# EAGLE design bristol_longshot_development (EAGLE 6.6.0)
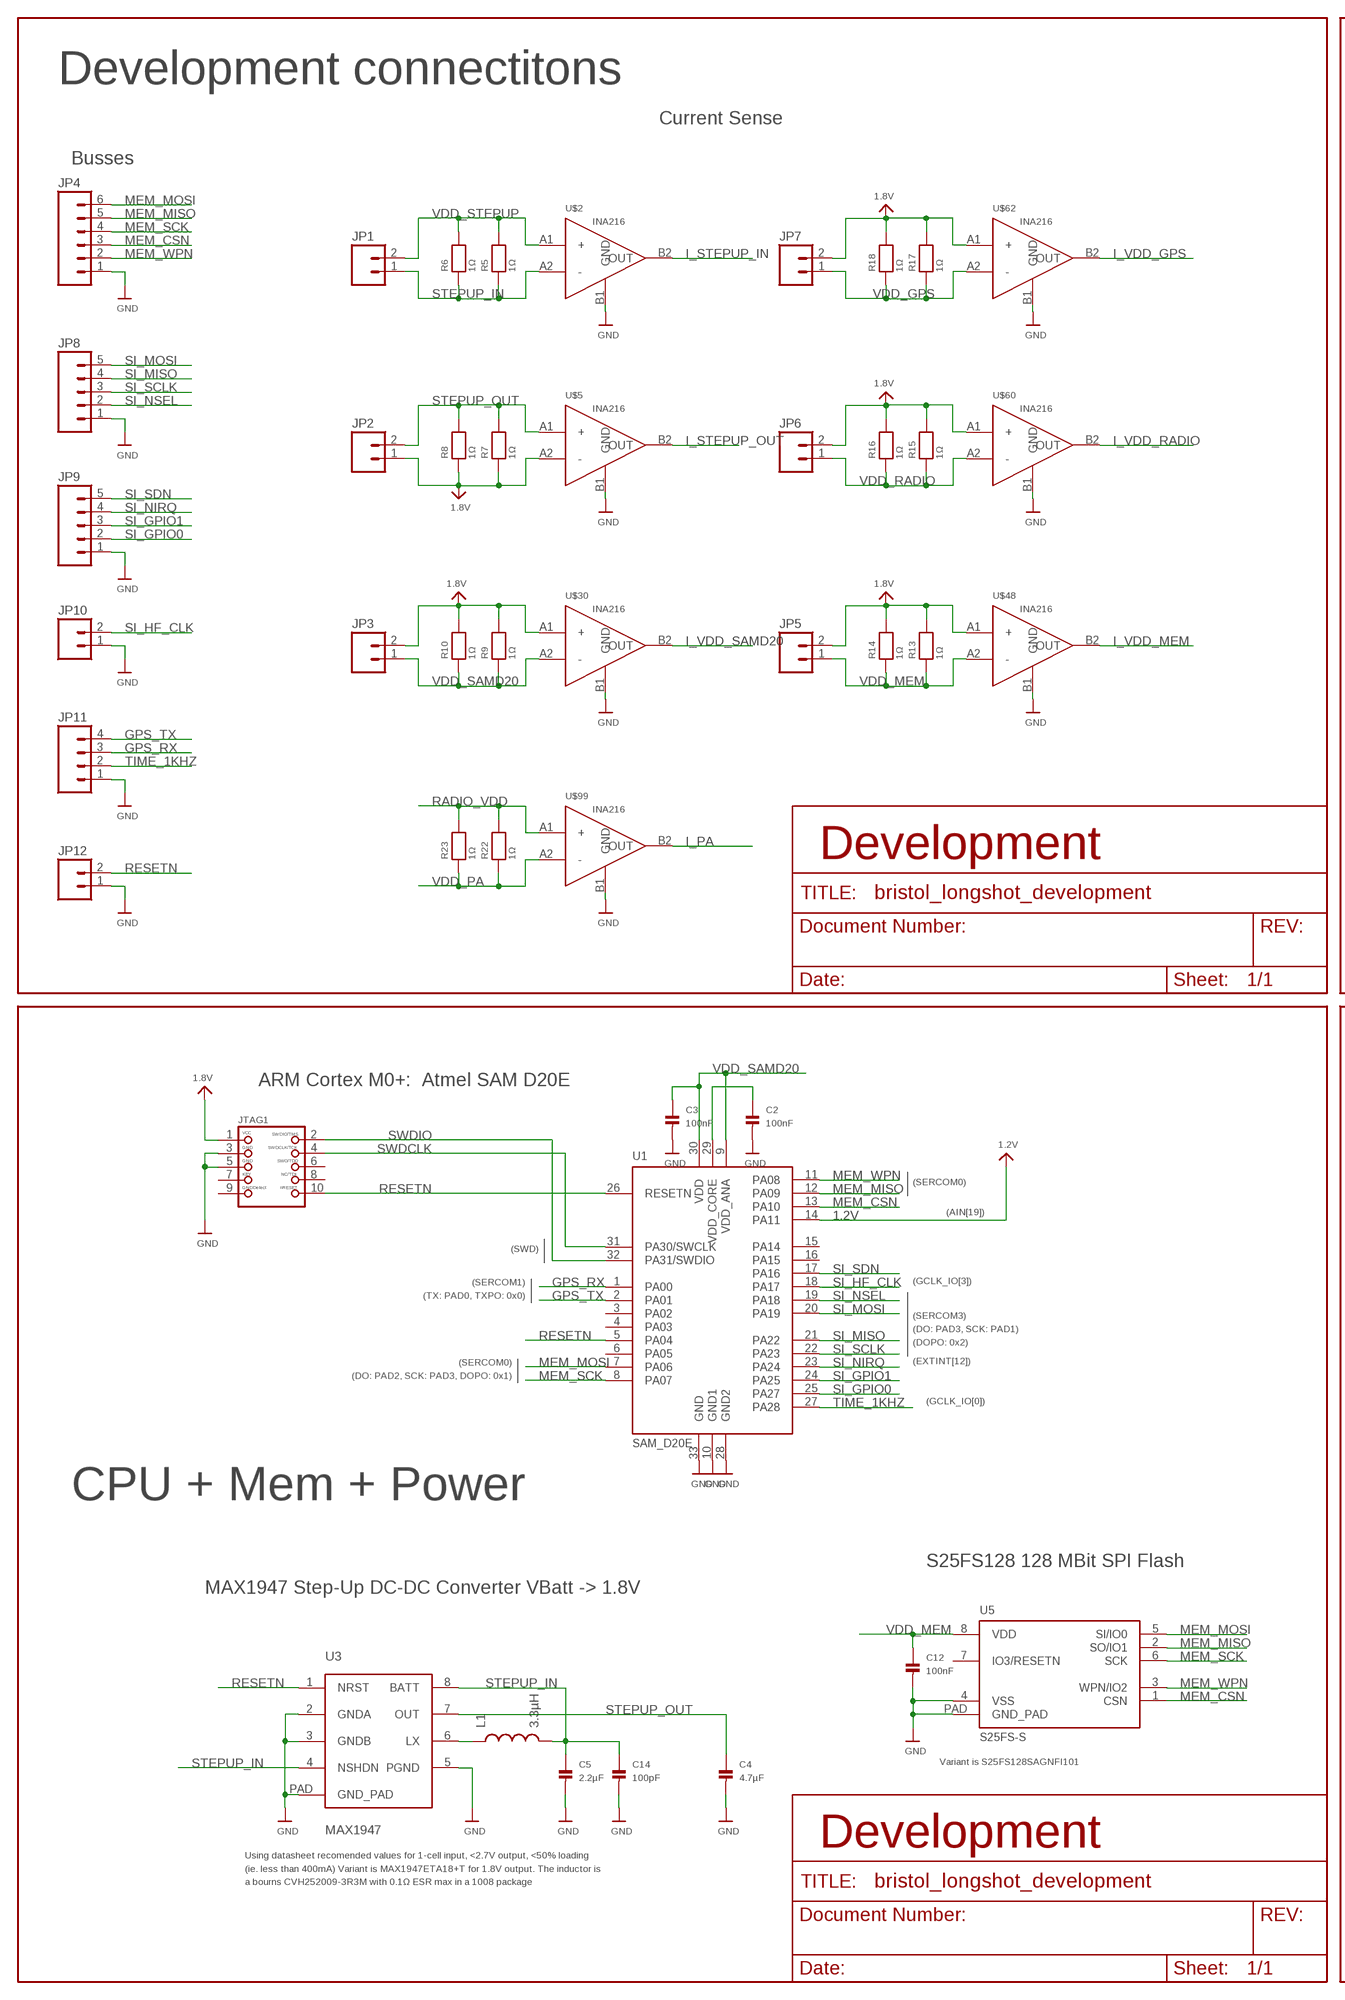
[diagram p0: schematic, sheet 1, part 1 of 2]
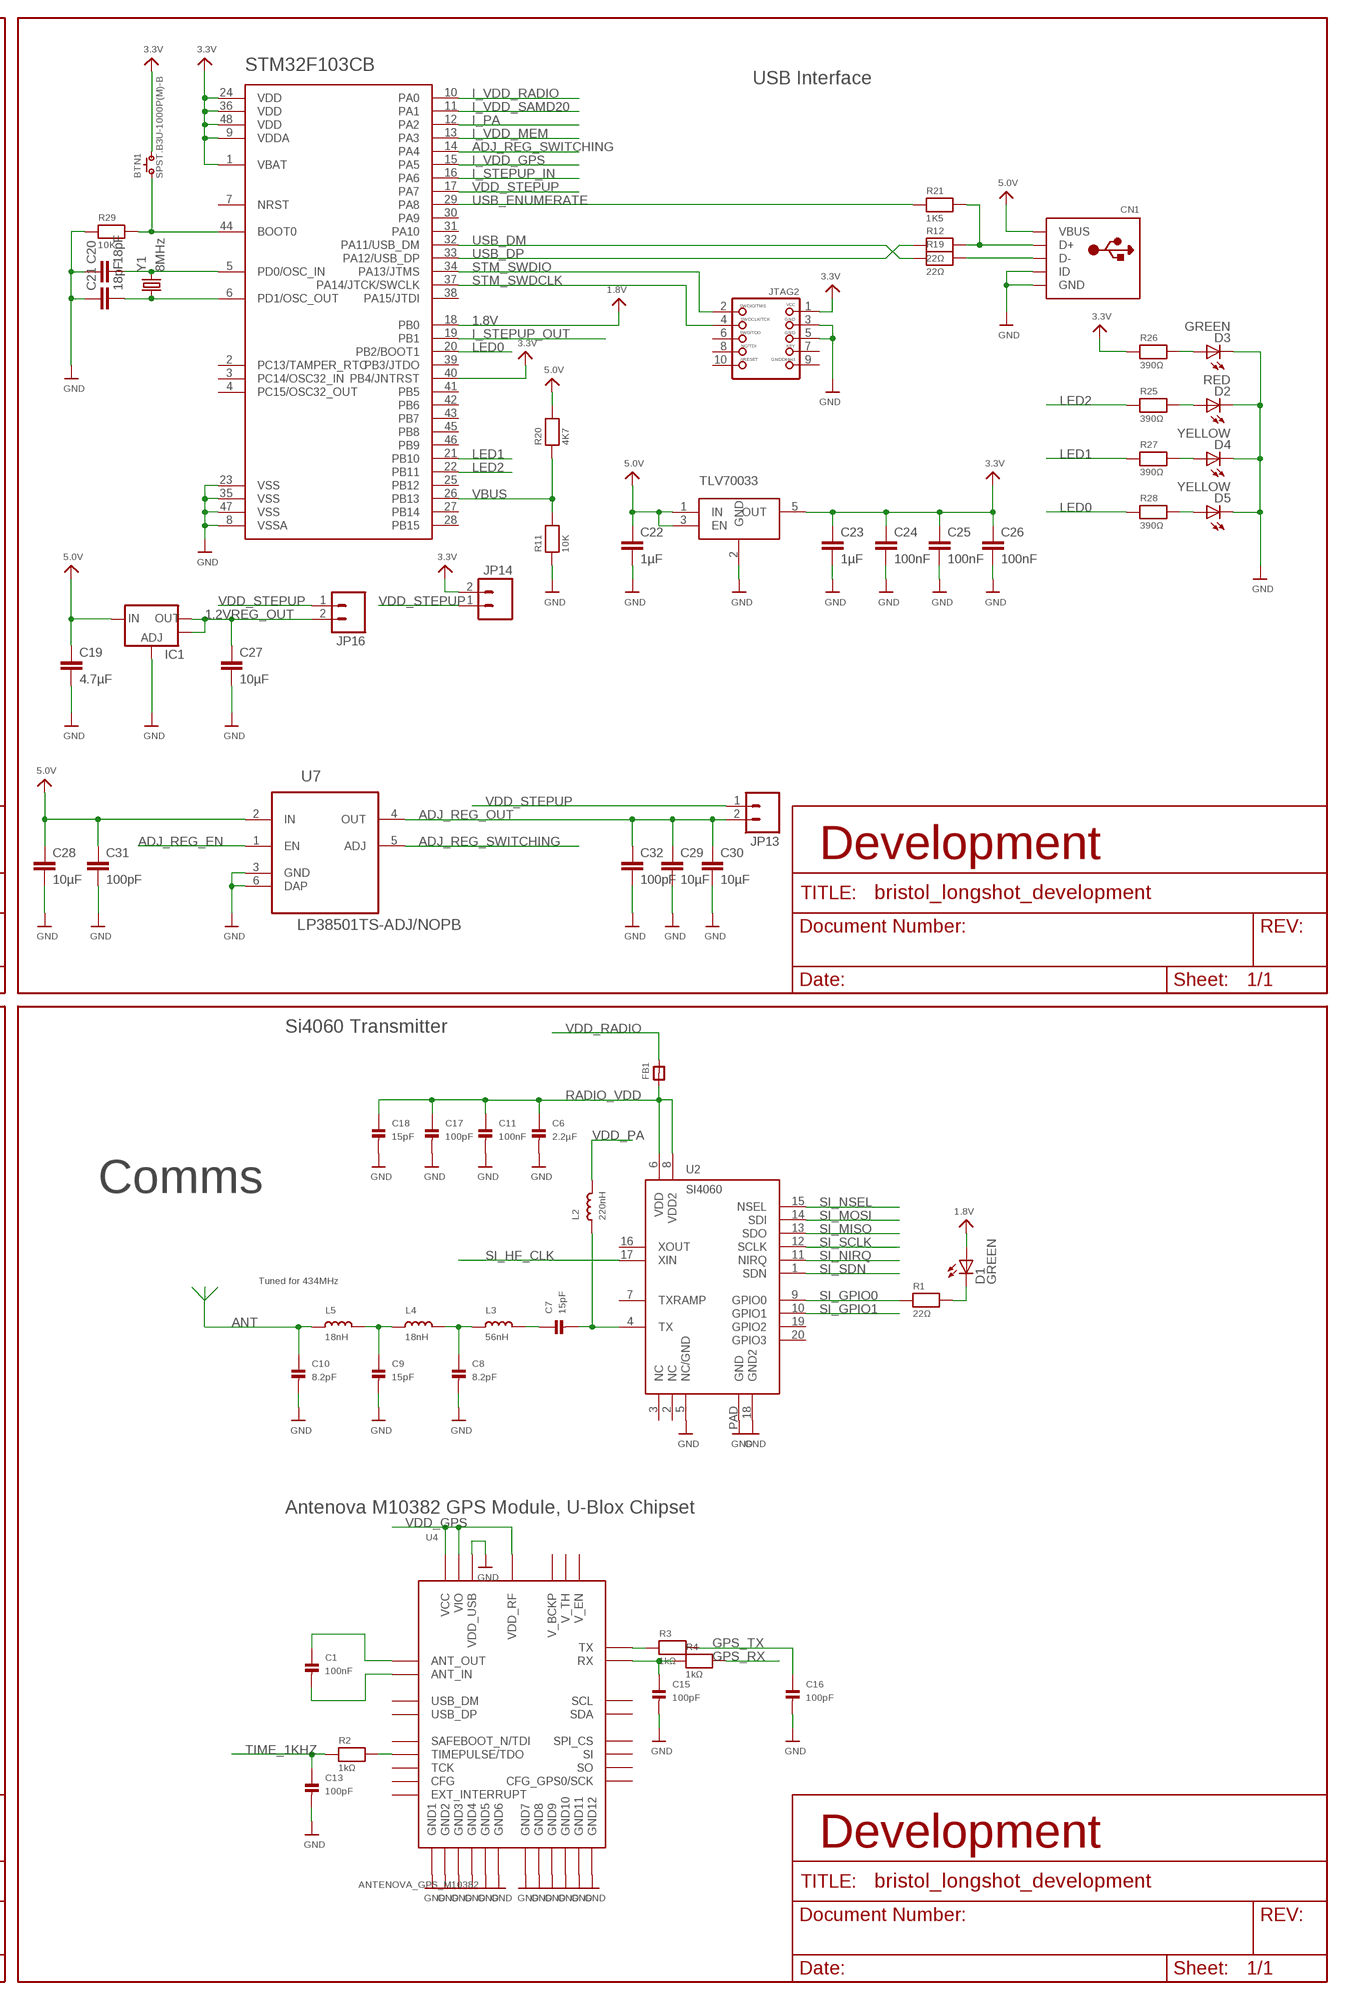
[diagram p1: schematic, sheet 1, part 2 of 2]

## Parts
BTN1  SPST.B3U-1000P(M)-B  [B3U-1000P(M)-B]
C1  100nF  CAP_CERAMIC_0402  [_0402]
C2  100nF  CAP_CERAMIC_0402  [_0402]
C3  100nF  CAP_CERAMIC_0402  [_0402]
C4  4.7µF  CAP_CERAMIC_0402  [_0402]
C5  2.2µF  CAP_CERAMIC_0402  [_0402]
C6  2.2µF  CAP_CERAMIC_0402  [_0402]
C7  15pF  CAP_CERAMIC_0402  [_0402]
C8  8.2pF  CAP_CERAMIC_0402  [_0402]
C9  15pF  CAP_CERAMIC_0402  [_0402]
C10  8.2pF  CAP_CERAMIC_0402  [_0402]
C11  100nF  CAP_CERAMIC_0402  [_0402]
C12  100nF  CAP_CERAMIC_0402  [_0402]
C13  100pF  CAP_CERAMIC_0402  [_0402]
C14  100pF  CAP_CERAMIC_0402  [_0402]
C15  100pF  CAP_CERAMIC_0402  [_0402]
C16  100pF  CAP_CERAMIC_0402  [_0402]
C17  100pF  CAP_CERAMIC_0402  [_0402]
C18  15pF  CAP_CERAMIC_0402  [_0402]
C19  4.7µF  C-EUC0603K  [C0603K]
C20  18pF  C-EUC0603K  [C0603K]
C21  18pF  C-EUC0603K  [C0603K]
C22  1µF  C-EUC0603K  [C0603K]
C23  1µF  C-EUC0603K  [C0603K]
C24  100nF  C-EUC0603K  [C0603K]
C25  100nF  C-EUC0603K  [C0603K]
C26  100nF  C-EUC0603K  [C0603K]
C27  10µF  C-EUC0603K  [C0603K]
C28  10µF  C-EUC0603K  [C0603K]
C29  10µF  C-EUC0603K  [C0603K]
C30  10µF  C-EUC0603K  [C0603K]
C31  100pF  C-EUC0603K  [C0603K]
C32  100pF  C-EUC0603K  [C0603K]
CN1  USBMINIB  [USB-MINIB]
D1  GREEN  LEDCHIPLED_0603  [CHIPLED_0603]
D2  RED  LEDCHIPLED_0603  [CHIPLED_0603]
D3  GREEN  LEDCHIPLED_0603  [CHIPLED_0603]
D4  YELLOW  LEDCHIPLED_0603  [CHIPLED_0603]
D5  YELLOW  LEDCHIPLED_0603  [CHIPLED_0603]
FB1  FERRITE_0402  [_0402]
IC1  V_REG_LM1117SOT223  [SOT223]
IC3  TLV70033DCK  TLV700DCK  [SC70-5L]
JP1  M02LOCK  [1X02_LOCK]
JP2  M02LOCK  [1X02_LOCK]
JP3  M02LOCK  [1X02_LOCK]
JP4  M06LOCK  [1X06_LOCK]
JP5  M02LOCK  [1X02_LOCK]
JP6  M02LOCK  [1X02_LOCK]
JP7  M02LOCK  [1X02_LOCK]
JP8  M05LOCK  [1X05_LOCK]
JP9  M05LOCK  [1X05_LOCK]
JP10  M02LOCK  [1X02_LOCK]
JP11  M04LOCK  [1X04_LOCK]
JP12  M02LOCK  [1X02_LOCK]
JP13  M02LOCK  [1X02_LOCK]
JP14  M02LOCK  [1X02_LOCK]
JP16  M02LOCK  [1X02_LOCK]
JTAG1  JTAG-CORTEXM3SMT  [2X05_1.27MM_SMT]
JTAG2  JTAG-CORTEXM3SMT  [2X05_1.27MM_SMT]
L1  3.3µH  INDUCTOR1007  [1007]
L2  220nH  INDUCTOR_0402  [_0402]
L3  56nH  INDUCTOR_0402  [_0402]
L4  18nH  INDUCTOR_0402  [_0402]
L5  18nH  INDUCTOR_0402  [_0402]
R1  22Ω  RESISTOR_0402  [_0402]
R2  1kΩ  RESISTOR_0402  [_0402]
R3  1kΩ  RESISTOR_0402  [_0402]
R4  1kΩ  RESISTOR_0402  [_0402]
R5  1Ω  RESISTOR_0402  [_0402]
R6  1Ω  RESISTOR_0402  [_0402]
R7  1Ω  RESISTOR_0402  [_0402]
R8  1Ω  RESISTOR_0402  [_0402]
R9  1Ω  RESISTOR_0402  [_0402]
R10  1Ω  RESISTOR_0402  [_0402]
R11  10K  RESISTOR0603MINI  [0603-MINI]
R12  22Ω  RESISTOR0603MINI  [0603-MINI]
R13  1Ω  RESISTOR_0402  [_0402]
R14  1Ω  RESISTOR_0402  [_0402]
R15  1Ω  RESISTOR_0402  [_0402]
R16  1Ω  RESISTOR_0402  [_0402]
R17  1Ω  RESISTOR_0402  [_0402]
R18  1Ω  RESISTOR_0402  [_0402]
R19  22Ω  RESISTOR0603MINI  [0603-MINI]
R20  4K7  RESISTOR0603MINI  [0603-MINI]
R21  1K5  RESISTOR0603MINI  [0603-MINI]
R22  1Ω  RESISTOR_0402  [_0402]
R23  1Ω  RESISTOR_0402  [_0402]
R25  390Ω  RESISTOR0603MINI  [0603-MINI]
R26  390Ω  RESISTOR0603MINI  [0603-MINI]
R27  390Ω  RESISTOR0603MINI  [0603-MINI]
R28  390Ω  RESISTOR0603MINI  [0603-MINI]
R29  10K  RESISTOR0603MINI  [0603-MINI]
U1  SAM_D20E  [QFN32_5MM]
U2  SI4060  [QFN20]
U3  MAX1947  [TDFN8]
U4  ANTENOVA_GPS_M10382  [ANTENOVA_GPS_M10382]
U5  S25FS-S  [WSON8]
U6  STM32F_48PIN  [TQFP48]
U7  LP38501TS-ADJ/NOPB  [TO170P1435X457-6N]
U$2  INA216  [WCSP-4]
U$5  INA216  [WCSP-4]
U$30  INA216  [WCSP-4]
U$48  INA216  [WCSP-4]
U$60  INA216  [WCSP-4]
U$62  INA216  [WCSP-4]
U$99  INA216  [WCSP-4]
Y1  8MHz  CRYSTAL5X3  [CRYSTAL-SMD-5X3]

## Nets
1.2V: U1.14(PA11)
1.2VREG_OUT: C27.1 IC1.2(OUT) IC1.4(OUT) JP16.2
1.8V: D1.A JP2.1 JP3.2 JP5.2 JP6.2 JP7.2 JTAG1.1 R7.1 R8.1 R9.2 R10.2 R13.2 R14.2 R15.2 R16.2 R17.2 R18.2 U6.18(PB0) U$5.A2(-) U$30.A1(+) U$48.A1(+) U$60.A1(+) U$62.A1(+)
3.3V: BTN1.2 C23.1 C24.1 C25.1 C26.1 IC3.5(OUT) JP14.2 JTAG2.1 R26.1 U6.1(VBAT) U6.9(VDDA) U6.24(VDD) U6.36(VDD) U6.40(PB4/JNTRST) U6.48(VDD)
5.0V: C19.1 C22.1 C28.1 C31.1 CN1.VBUS IC1.3(IN) IC3.1(IN) IC3.3(EN) R20.2 U7.2(IN)
ADJ_REG_EN: U7.1(EN)
ADJ_REG_OUT: C29.1 C30.1 C32.1 JP13.2 U7.4(OUT)
ADJ_REG_SWITCHING: U6.14(PA4) U7.5(ADJ)
AN_GPS_RX: C15.1 R4.1 U4.13_RX(RX)
AN_GPS_TX: R3.1 U4.11_TX(TX)
ANT: C10.1 L5.1
BOOT0: BTN1.1 R29.2 U6.44(BOOT0)
D+: CN1.D+ R12.2 R21.2
D-: CN1.D- R19.2
FILTER1: C8.1 L3.1 L4.2
FILTER2: C9.1 L4.1 L5.2
GND: C2.2 C3.2 C4.2 C5.2 C6.2 C8.2 C9.2 C10.2 C11.2 C12.2 C13.2 C14.2 C15.2 C16.2 C17.2 C18.2 C19.2 C20.1 C21.1 C22.2 C23.2 C24.2 C25.2 C26.2 C27.2 C28.2 C29.2 C30.2 C31.2 C32.2 CN1.GND CN1.ID D2.C D3.C D4.C D5.C IC1.1(ADJ) IC3.2(GND) JP4.1 JP8.1 JP9.1 JP10.1 JP11.1 JP12.1 JTAG1.3 JTAG1.5 JTAG2.3 JTAG2.5 R11.1 R29.1 U1.10(GND1) U1.28(GND2) U1.33(GND) U2.5(NC/GND) U2.18(GND2) U2.PAD(GND) U3.2(GNDA) U3.3(GNDB) U3.5(PGND) U3.PAD(GND_PAD) U4.2_GND(GND1) U4.4_GND(GND2) U4.14_GND(GND3) U4.17_GND(GND4) U4.21_GND(GND5) U4.24_GND(GND6) U4.26_GND(GND7) U4.28_GND(GND8) U4.32_VDD_USB(VDD_USB) U4.33_GND(GND9) U4.34_GND(GND10) U4.35_GND(GND11) U4.36_GND(GND12) U5.4(VSS) U5.PAD(GND_PAD) U6.8(VSSA) U6.23(VSS) U6.35(VSS) U6.47(VSS) U7.3(GND) U7.6(DAP) U$2.B1(GND) U$5.B1(GND) U$30.B1(GND) U$48.B1(GND) U$60.B1(GND) U$62.B1(GND) U$99.B1(GND)
GPS_ANT_IN: C1.2 U4.1_ANT_IN(ANT_IN)
GPS_ANT_OUT: C1.1 U4.3_ANT_OUT(ANT_OUT)
GPS_RX: JP11.3 R4.2 U1.1(PA00)
GPS_TX: C16.1 JP11.4 R3.2 U1.2(PA01)
I_PA: U6.12(PA2) U$99.B2(OUT)
I_STEPUP_IN: U6.16(PA6) U$2.B2(OUT)
I_STEPUP_OUT: U6.19(PB1) U$5.B2(OUT)
I_VDD_GPS: U6.15(PA5) U$62.B2(OUT)
I_VDD_MEM: U6.13(PA3) U$48.B2(OUT)
I_VDD_RADIO: U6.10(PA0) U$60.B2(OUT)
I_VDD_SAMD20: U6.11(PA1) U$30.B2(OUT)
LED0: R28.1 U6.20(PB2/BOOT1)
LED1: R27.1 U6.21(PB10)
LED2: R25.1 U6.22(PB11)
LED_RES: D1.C R1.2
LPC_XTAL2: C21.2 U6.6(PD1/OSC_OUT) Y1.1
LX: L1.1 U3.6(LX)
MEM_CSN: JP4.3 U1.13(PA10) U5.1(CSN)
MEM_MISO: JP4.5 U1.12(PA09) U5.2(SO/IO1)
MEM_MOSI: JP4.6 U1.7(PA06) U5.5(SI/IO0)
MEM_SCK: JP4.4 U1.8(PA07) U5.6(SCK)
MEM_WPN: JP4.2 U1.11(PA08) U5.3(WPN/IO2)
N$2: D2.A R25.2
N$4: D3.A R26.2
N$6: D4.A R27.2
N$8: D5.A R28.2
OSC_IN: C20.2 U6.5(PD0/OSC_IN) Y1.3
RADIO_VDD: C6.1 C11.1 C17.1 C18.1 FB1.1 R22.2 R23.2 U2.6(VDD) U2.8(VDD2) U$99.A1(+)
RESETN: JP12.2 JTAG1.10 U1.5(PA04) U1.26(RESETN) U3.1(NRST)
RF_OUT: C7.2 L2.1 U2.4(TX)
SI_GPIO0: JP9.2 R1.1 U1.25(PA27) U2.9(GPIO0)
SI_GPIO1: JP9.3 U1.24(PA25) U2.10(GPIO1)
SI_HF_CLK: JP10.2 U1.18(PA17) U2.17(XIN)
SI_MISO: JP8.4 U1.21(PA22) U2.13(SDO)
SI_MOSI: JP8.5 U1.20(PA19) U2.14(SDI)
SI_NIRQ: JP9.4 U1.23(PA24) U2.11(NIRQ)
SI_NSEL: JP8.2 U1.19(PA18) U2.15(NSEL)
SI_SCLK: JP8.3 U1.22(PA23) U2.12(SCLK)
SI_SDN: JP9.5 U1.17(PA16) U2.1(SDN)
STEPUP_IN: C5.1 C14.1 JP1.1 L1.2 R5.1 R6.1 U3.4(NSHDN) U3.8(BATT) U$2.A2(-)
STEPUP_OUT: C4.1 JP2.2 R7.2 R8.2 U3.7(OUT) U$5.A1(+)
STM_SWDCLK: JTAG2.4 U6.37(PA14/JTCK/SWCLK)
STM_SWDIO: JTAG2.2 U6.34(PA13/JTMS)
SWDCLK: JTAG1.4 U1.31(PA30/SWCLK)
SWDIO: JTAG1.2 U1.32(PA31/SWDIO)
TANK: C7.1 L3.2
TIME_1KHZ: C13.1 JP11.2 R2.1 U1.27(PA28)
TIME_1KHZ_DRIVE: R2.2 U4.23_TIMEPULSE/TDO(TIMEPULSE/TDO)
USB_DM: R19.1 U6.32(PA11/USB_DM)
USB_DP: R12.1 U6.33(PA12/USB_DP)
USB_ENUMERATE: R21.1 U6.29(PA8)
VBUS: R11.2 R20.1 U6.26(PB13)
VDD_CORE: C2.1 U1.29(VDD_CORE)
VDD_GPS: JP7.1 R17.1 R18.1 U4.5_VIO(VIO) U4.25_VDD_RF(VDD_RF) U4.27_VCC(VCC) U$62.A2(-)
VDD_MEM: C12.1 JP5.1 R13.1 R14.1 U5.8(VDD) U$48.A2(-)
VDD_PA: L2.2 R22.1 R23.1 U$99.A2(-)
VDD_RADIO: FB1.2 JP6.1 R15.1 R16.1 U$60.A2(-)
VDD_SAMD20: C3.1 JP3.1 R9.1 R10.1 U1.9(VDD_ANA) U1.30(VDD) U$30.A2(-)
VDD_STEPUP: JP1.2 JP13.1 JP14.1 JP16.1 R5.2 R6.2 U6.17(PA7) U$2.A1(+)
Unconnected: JTAG1.6 JTAG1.7 JTAG1.8 JTAG1.9 JTAG2.6 JTAG2.7 JTAG2.8 JTAG2.9 JTAG2.10 U1.3(PA02) U1.4(PA03) U1.6(PA05) U1.15(PA14) U1.16(PA15) U2.2(NC) U2.3(NC ) U2.7(TXRAMP) U2.16(XOUT) U2.19(GPIO2) U2.20(GPIO3) U4.6_USB_DP(USB_DP) U4.7_USB_DM(USB_DM) U4.8_SO(SO) U4.9_CFG_GPS0_SCK(CFG_GPS0/SCK) U4.10_SPI_SELECT(SPI_CS) U4.12_V_TH(V_TH) U4.15_V_BCKUP(V_BCKP) U4.16_SI(SI) U4.18_SDA(SDA) U4.19_SCL(SCL) U4.20_SAFEBOOT_N/TDI(SAFEBOOT_N/TDI) U4.22_TCK(TCK) U4.29_EXT_INTERRUPT(EXT_INTERRUPT) U4.30_V_EN(V_EN) U4.31_CFG(CFG) U5.7(IO3/RESETN) U6.2(PC13/TAMPER_RTC) U6.3(PC14/OSC32_IN) U6.4(PC15/OSC32_OUT) U6.7(NRST) U6.25(PB12) U6.27(PB14) U6.28(PB15) U6.30(PA9) U6.31(PA10) U6.38(PA15/JTDI) U6.39(PB3/JTDO) U6.41(PB5) U6.42(PB6) U6.43(PB7) U6.45(PB8) U6.46(PB9)

## Notes on the sheet
- STM32F103CB
- Development connectitons | USB Interface
- Current Sense
- Busses
- TLV70033
- Development | Development
- Si4060 Transmitter
- ARM Cortex M0+:  Atmel SAM D20E
- (SERCOM0)
- Comms
- (AIN[19])
- (SWD)
- (SERCOM1) | (GCLK_IO[3]) | Tuned for 434MHz
- (TX: PAD0, TXPO: 0x0)
- (SERCOM3)
- (DO: PAD3, SCK: PAD1)
- (DOPO: 0x2)
- (SERCOM0) | (EXTINT[12])
- (DO: PAD2, SCK: PAD3, DOPO: 0x1)
- (GCLK_IO[0])
- CPU + Mem + Power
- Antenova M10382 GPS Module, U-Blox Chipset
- S25FS128 128 MBit SPI Flash
- MAX1947 Step-Up DC-DC Converter VBatt -> 1.8V
- Variant is S25FS128SAGNFI101
- Development | Development
- Using datasheet recomended values for 1-cell input, <2.7V output, <50% loading 
  (ie. less than 400mA) Variant is MAX1947ETA18+T for 1.8V output. The inductor is 
  a bourns CVH252009-3R3M with 0.1Ω ESR max in a 1008 package

## Library data of the parts
BTN1 = omron:SPST
C1-C18 = microbuilder_v3:CAP_CERAMIC: Ceramic Capacitors 0402 - 0402 Surface Mount Capacitors 16pF 50V 5% [Digikey: 445-4899-2-ND] 18pF 50V 5% [Digikey: 490-1281-2-ND] 22pF 50V 5% [Digikey: 490-1283-2-ND] 68pF 50V 5% [Digikey: 490-1289-2-ND] 0.1uF 10V 10% [Digikey: 490-1318-2-ND] 1.0uF 6.3V 10% [Digikey: 490-1320-2-ND] 0603 - 0603 Surface Mount Capacitors 16 pF 50V 5% [Digikey: 445-5051-2-ND] 22 pF 50V [Digikey: PCC220ACVTR-ND] 33 pF 50V 5% [Digikey: 490-1415-1-ND] 56pF 50V 5% [Digikey: 490-1421-1-ND] 220pF 50V 5% [Digikey: 445-1285-1-ND] 680 pF 50V 2200 pF 50V 5% C0G [Digikey: 445-1297-1-ND] 5600 pF 100V 5% X7R [Digikey: 478-3711-1-ND] 0.1 µF 25V 10% [Digikey: PCC2277TR-ND] 0.22 µF 16V 10% X7R [Digikey: 445-1318-1-ND] 1.0 µF 25V 10% [Digikey: 445-5146-2-ND] 0603 - RF Specific 3pF 250V +/-0.1pF RF [Digikey: 712-1347-1-ND] 18 pF 250V 5% [Digikey: 478-3505-1-ND or 712-1322-1-ND] 56 pF 250V 5% C0G RF [Digikey: 490-4867-1-ND] 68 pF 250V RF [Digikey: 490-4868-1-ND] 0805 - 0805 Surface Mount Capacitors 220 pF 250V 2% RF Ceramic Capacitor [Digikey: 712-1398-1-ND] 1000 pF 50V 2% NP0 Ceramic Capacitor [Digikey: 478-3760-1-ND] 0.1 µF 25V 10% Ceramic Capacitor [Digikey: PCC1828TR-ND] 1.0 µF 16V 10% Ceramic Capacitor[Digikey: 490-1691-2-ND] 10.0 µF 10V 10% Ceramic Capacitor[Digikey: 709-1228-1-ND] 10.0 uF 16V 10% Ceramic Capacitor [Digikey: 478-5165-2-ND] 47 uF 6.3V 20% Ceramic Capacitor [Digikey: 587-1779-1-ND or 399-5506-1-ND] 1206 - 1206 Surface Mount Capacitors 47uF 10V 20% Ceramic Capacitor [Digikey: 490-5528-1-ND or 399-5508-1-ND or 445-6010-1-ND] 100uF 6.3V -20%, +80% Y5V Ceramic Capacitor (Digikey: 490-4512-1-ND, Mouser: 81-GRM31CF50J107ZE1L)
C19-C32 = resistor:C-EU: CAPACITOR, European symbol
CN1 = microbuilder_v3:USB: USB Connectors USBMINIB - Surface Mount Female Mini-B USB Connector 4UConnector: 06564
D1-D5 = led:LED: LED OSRAM: - CHIPLED LG R971, LG N971, LY N971, LG Q971, LY Q971, LO R971, LY R971 LH N974, LH R974 LS Q976, LO Q976, LY Q976 LO Q996 - Hyper CHIPLED LW Q18S LB Q993, LB Q99A, LB R99A - SideLED LS A670, LO A670, LY A670, LG A670, LP A670 LB A673, LV A673, LT A673, LW A673 LH A674 LY A675 LS A676, LA A676, LO A676, LY A676, LW A676 LS A679, LY A679, LG A679 - Hyper Micro SIDELED® LS Y876, LA Y876, LO Y876, LY Y876 LT Y87S - SmartLED LW L88C, LW L88S LB L89C, LB L89S, LG L890 LS L89K, LO L89K, LY L89K LS L896, LA L896, LO L896, LY L896 - TOPLED LS T670, LO T670, LY T670, LG T670, LP T670 LSG T670, LSP T670, LSY T670, LOP T670, LYG T670 LG T671, LOG T671, LSG T671 LB T673, LV T673, LT T673, LW T673 LH T674 LS T676, LA T676, LO T676, LY T676, LB T676, LH T676, LSB T676, LW T676 LB T67C, LV T67C, LT T67C, LS T67K, LO T67K, LY T67K, LW E67C LS E67B, LA E67B, LO E67B, LY E67B, LB E67C, LV E67C, LT E67C LW T67C LS T679, LY T679, LG T679 LS T770, LO T770, LY T770, LG T770, LP T770 LB T773, LV T773, LT T773, LW T773 LH T774 LS E675, LA E675, LY E675, LS T675 LS T776, LA T776, LO T776, LY T776, LB T776 LHGB T686 LT T68C, LB T68C - Hyper Mini TOPLED® LB M676 - Mini TOPLED Santana® LG M470 LS M47K, LO M47K, LY M47K Source: http://www.osram.convergy.de LUXEON: - LUMILED® LXK2-PW12-R00, LXK2-PW12-S00, LXK2-PW14-U00, LXK2-PW14-V00 LXK2-PM12-R00, LXK2-PM12-S00, LXK2-PM14-U00 LXK2-PE12-Q00, LXK2-PE12-R00, LXK2-PE12-S00, LXK2-PE14-T00, LXK2-PE14-U00 LXK2-PB12-K00, LXK2-PB12-L00, LXK2-PB12-M00, LXK2-PB14-N00, LXK2-PB14-P00, LXK2-PB14-Q00 LXK2-PR12-L00, LXK2-PR12-M00, LXK2-PR14-Q00, LXK2-PR14-R00 LXK2-PD12-Q00, LXK2-PD12-R00, LXK2-PD12-S00 LXK2-PH12-R00, LXK2-PH12-S00 LXK2-PL12-P00, LXK2-PL12-Q00, LXK2-PL12-R00 Source: www.luxeon.com KINGBRIGHT: KA-3528ASYC Source: www.kingbright.com
FB1 = microbuilder_v3:FERRITE: Ferrite Bead 0603 MMZ1608B121C - 120 Ohm @ 100MHz, 600mA, 0.15 Ohm DC Resistance - Digikey: 445-2164-1-ND BK1608HW121-T - 120 Ohm, 600mA Ferrite Chip - Digikey: 587-1876-2-ND 0805 HZ0805B272R-10 - 2.7K Ohm @ 100MHz, 200mA, 0.8 Ohm DC Resistance - Digikey: 240-2504-1-ND (see also Murata BLM21BD272SN1L) MMZ2012Y152B - 1.5K Ohm @ 100MHz, 500mA, 0.4 Ohm DC Resistance - Digikey: 445-1560-1-ND - Mainly for high frequency (80-400MHz) MMZ2012R102A - 1K Ohm @ 100MHz, 500mA, 0.3 Ohm DC Resistance - Digikey: 445-1555-2-ND - More general purpose (10-200MHz)
IC1 = SparkFun:V_REG_LM1117: Voltage Regulator LM1117 Standard adjustable voltage regulator but in SMD form. Spark Fun Electronics SKU : COM-00595
IC3 = tlv700:TLV700
JP1-JP3 JP5-JP7 JP10 JP12-JP14 JP16 = SparkFun:M02: Header 2 Standard 2-pin 0.1" header. Use with straight break away headers (SKU : PRT-00116), right angle break away headers (PRT-00553), swiss pins (PRT-00743), machine pins (PRT-00117), and female headers (PRT-00115). Molex polarized connector foot print use with SKU : PRT-08233 with associated crimp pins and housings.
JP4 = SparkFun:M06: Header 6 Standard 6-pin 0.1" header. Use with straight break away headers (SKU : PRT-00116), right angle break away headers (PRT-00553), swiss pins (PRT-00743), machine pins (PRT-00117), and female headers (PRT-00115). Molex polarized connector foot print use with SKU : PRT-08094 with associated crimp pins and housings. NOTES ON THE VARIANTS LOCK and LOCK_LONGPADS... This footprint was designed to help hold the alignment of a through-hole component (i.e. 6-pin header) while soldering it into place. You may notice that each hole has been shifted either up or down by 0.005 of an inch from it's more standard position (which is a perfectly straight line). This slight alteration caused the pins (the squares in the middle) to touch the edges of the holes. Because they are alternating, it causes a "brace" to hold the component in place. 0.005 has proven to be the perfect amount of "off-center" position when using our standard breakaway headers. Although looks a little odd when you look at the bare footprint, once you have a header in there, the alteration is very hard to notice. Also, if you push a header all the way into place, it is covered up entirely on the bottom side. This idea of altering the position of holes to aid alignment will be further integrated into the Sparkfun Library for other footprints. It can help hold any component with 3 or more connection pins.
JP8 JP9 = SparkFun:M05: Header 5 Standard 5-pin 0.1" header. Use with straight break away headers (SKU : PRT-00116), right angle break away headers (PRT-00553), swiss pins (PRT-00743), machine pins (PRT-00117), and female headers (PRT-00115). Molex polarized connector foot print use with SKU : PRT-08230 with associated crimp pins and housings.
JP11 = SparkFun:M04: Header 4 Standard 4-pin 0.1" header. Use with straight break away headers (SKU : PRT-00116), right angle break away headers (PRT-00553), swiss pins (PRT-00743), machine pins (PRT-00117), and female headers (PRT-00115). Molex polarized connector foot print use with SKU : PRT-08231 with associated crimp pins and housings. 1MM SMD Version SKU: PRT-10208
JTAG1 JTAG2 = microbuilder_v3:JTAG-CORTEXM3: Serial Wire (SW-DP) Connector This standard 0.05" 10-pin connector is for use with the Cortex M0/M3's native SWD (serial wire debugger) interface (SW-DP). Some boards support a 20-pin combined JTAG+SWD connector (SWJ-DP), such as the LPC1700 family, but many smaller devices only work with SWD which typically use the smaller 10-pin SW-DP connecter (the LPC1300 family, for example, only supports SWD). 2x05 1.27mm/0.05" Connector: This is the standard SMT connector defined by ARM for all Cortex devices, and should be used in most situations and for forward-compatibility since any new devices coming to market will likely use this connector. MOLEX 10 Pin 0.1" Connector: This 0.1" 10 pin connector has the same pin layout as the standard 0.05" connector, but is easier to work with if you are using standard jumper wires or custom cables to connect your SWD hardware. MOLEX 20 Pin 0.1" Connector: This 0.1" 20 pin connector is the same model used for ARM7/ARM9 JTAG debuggers, but is connected to match the pins on the Segger J-Link for ARM (which supports both JTAG and SWD debugging). See the following document from ARM for more information on Cortex M3 Debug Connectors: http://infocenter.arm.com/help/topic/com.arm.doc.faqs/attached/13634/cortex_debug_connectors.pdf And the following page for an overview with images of the different connector types: http://www.keil.com/peripherals/coresight/connectors.asp
L1 = SparkFun:INDUCTOR: Inductors
L2-L5 = microbuilder_v3:INDUCTOR: Inductors
R1-R10 R13-R18 R22 R23 = microbuilder_v3:RESISTOR: Resistors 0402 - 0402 Surface Mount Package 22 Ohm 1% 1/16W [Digikey: 311-22.0LRTR-ND] 33 Ohm 5% 1/16W 1.0K 5% 1/16W 1.5K 5% 1/16W 2.0K 1% 1/16W 10.0K 1% 1/16W [Digikey: 311-10.0KLRTR-ND] 10.0K 5% 1/16W [Digikey: RMCF0402JT10K0TR-ND] 12.1K 1% 1/16W [Digikey: 311-22.0LRTR-ND] 100.0K 5% 1/16W 0603 - 0603 Surface Mount Package 0 Ohm 1/10 Watt 1% Resistor 15 Ohm 1/10 Watt 1% Resistor 33 Ohm 1/10 Watt 1% Resistor 49.9 Ohm 1/10 Watt 1% Resistor 100 Ohm 1/10 Watt 1% Resistor 150 Ohm 1/10 Watt 1% Resistor 240 Ohm 1/10 Watt 1% Resistor 390 Ohm 1/10 Watt 1% Resistor 560 Ohm 1/10 Watt 1% Resistor 680 Ohm 1/10 Watt 1% Resistor 750 Ohm 1/10 Watt 1% Resistor 1.0K Ohm 1/10 Watt 1% Resistor 1.5K Ohm 1/10 Watt 1% Resistor 2.0K Ohm 1/10 Watt 1% Resistor 2.2K Ohm 1/10 Watt 1% Resistor 3.3K Ohm 1/10 Watt 1% Resistor 4.7K Ohm 1/10 Watt 1% Resistor 10.0K Ohm 1/10 Watt 1% Resistor 12.0K Ohm 1/10 Watt 1% Resistor 12.1K Ohm 1/10 Watt 1% Resistor 20.0K Ohm 1/10 Watt 1% Resistor 33.0K Ohm 1/10 Watt 1% Resistor 100.0K Ohm 1/10 Watt 1% Resistor 0805 - 0805 Surface Mount Package 0 Ohm 1/8 Watt 1% Resistor 33 Ohm 1/8 Watt 1% Resistor 100 Ohm 1/8 Watt 1% Resistor 150 Ohm 1/8 Watt 1% Resistor 200 Ohm 1/8 Watt 1% Resistor 240 Ohm 1/8 Watt 1% Resistor 330 Ohm 1/8 Watt 1% Resistor 390 Ohm 1/8 Watt 1% Resistor 470 Ohm 1/8 Watt 1% Resistor 1.0K Ohm 1/8 Watt 1% Resistor 1.5K Ohm 1/8 Watt 1% Resistor 2.0K Ohm 1/8 Watt 1% Resistor 4.7K Ohm 1/8 Watt 1% Resistor 5.1K Ohm 1/8 Watt 1% Resistor 5.6K Ohm 1/8 Watt 1% Resistor 10.0K Ohm 1/8 Watt 1% Resistor 22.0K Ohm 1/8 Watt 1% Resistor 33.0K Ohm 1/8 Watt 1% Resistor 100K Ohm 1/8 Watt 1% Resistor 1206 - 1206 Surface Mount Package 2012 - 2010 Surface Mount Package 0.11 Ohm 1/2 Watt 1% Resistor - Digikey: RHM.11UCT-ND
R11 R12 R19-R21 R25-R29 = microbuilder:RESISTOR: Resistors 0402 - 0402 Surface Mount Package 22 Ohm 1% 1/16W [Digikey: 311-22.0LRTR-ND] 33 Ohm 5% 1/16W 1.0K 5% 1/16W 1.5K 5% 1/16W 2.0K 1% 1/16W 10.0K 1% 1/16W [Digikey: 311-10.0KLRTR-ND] 10.0K 5% 1/16W [Digikey: RMCF0402JT10K0TR-ND] 12.1K 1% 1/16W [Digikey: 311-22.0LRTR-ND] 100.0K 5% 1/16W 0603 - 0603 Surface Mount Package 0 Ohm 1/10 Watt 1% Resistor 15 Ohm 1/10 Watt 1% Resistor 33 Ohm 1/10 Watt 1% Resistor 49.9 Ohm 1/10 Watt 1% Resistor 100 Ohm 1/10 Watt 1% Resistor 150 Ohm 1/10 Watt 1% Resistor 240 Ohm 1/10 Watt 1% Resistor 390 Ohm 1/10 Watt 1% Resistor 560 Ohm 1/10 Watt 1% Resistor 680 Ohm 1/10 Watt 1% Resistor 750 Ohm 1/10 Watt 1% Resistor 1.0K Ohm 1/10 Watt 1% Resistor 1.5K Ohm 1/10 Watt 1% Resistor 2.0K Ohm 1/10 Watt 1% Resistor 2.2K Ohm 1/10 Watt 1% Resistor 3.3K Ohm 1/10 Watt 1% Resistor 4.7K Ohm 1/10 Watt 1% Resistor 10.0K Ohm 1/10 Watt 1% Resistor 12.0K Ohm 1/10 Watt 1% Resistor 12.1K Ohm 1/10 Watt 1% Resistor 20.0K Ohm 1/10 Watt 1% Resistor 33.0K Ohm 1/10 Watt 1% Resistor 100.0K Ohm 1/10 Watt 1% Resistor 0805 - 0805 Surface Mount Package 0 Ohm 1/8 Watt 1% Resistor 33 Ohm 1/8 Watt 1% Resistor 100 Ohm 1/8 Watt 1% Resistor 150 Ohm 1/8 Watt 1% Resistor 200 Ohm 1/8 Watt 1% Resistor 240 Ohm 1/8 Watt 1% Resistor 330 Ohm 1/8 Watt 1% Resistor 390 Ohm 1/8 Watt 1% Resistor 470 Ohm 1/8 Watt 1% Resistor 1.0K Ohm 1/8 Watt 1% Resistor 1.5K Ohm 1/8 Watt 1% Resistor 2.0K Ohm 1/8 Watt 1% Resistor 4.7K Ohm 1/8 Watt 1% Resistor 5.1K Ohm 1/8 Watt 1% Resistor 5.6K Ohm 1/8 Watt 1% Resistor 10.0K Ohm 1/8 Watt 1% Resistor 22.0K Ohm 1/8 Watt 1% Resistor 33.0K Ohm 1/8 Watt 1% Resistor 100K Ohm 1/8 Watt 1% Resistor 1206 - 1206 Surface Mount Package 2012 - 2010 Surface Mount Package 0.11 Ohm 1/2 Watt 1% Resistor - Digikey: RHM.11UCT-ND
U1 = fbri:SAM_D20E
U2 = fbri:SI4060
U3 = fbri:MAX1947
U4 = fbri:ANTENOVA_GPS_M10382
U5 = fbri:S25FS-S
U6 = stm32f:STM32F_48PIN
U7 = LP38501TS-ADJ:LP38501TS-ADJ/NOPB: IC, 3A FlexCap Low Dropout Linear Regulator for 2.7V to 5.5V Inputs,TO263-5; MPN: LP38501TS-ADJ/NOPB; OC_FARNELL: 2102669; OC_NEWARK: 64M7063; PACKAGE: TO263-5; SUPPLIER: TEXAS INSTRUMENTS
U$2 U$5 U$30 U$48 U$60 U$62 U$99 = fbri:INA216
Y1 = SparkFun:CRYSTAL: Crystals Various standard crystals. Proven footprints. Spark Fun Electronics SKU : COM-00534

## Board
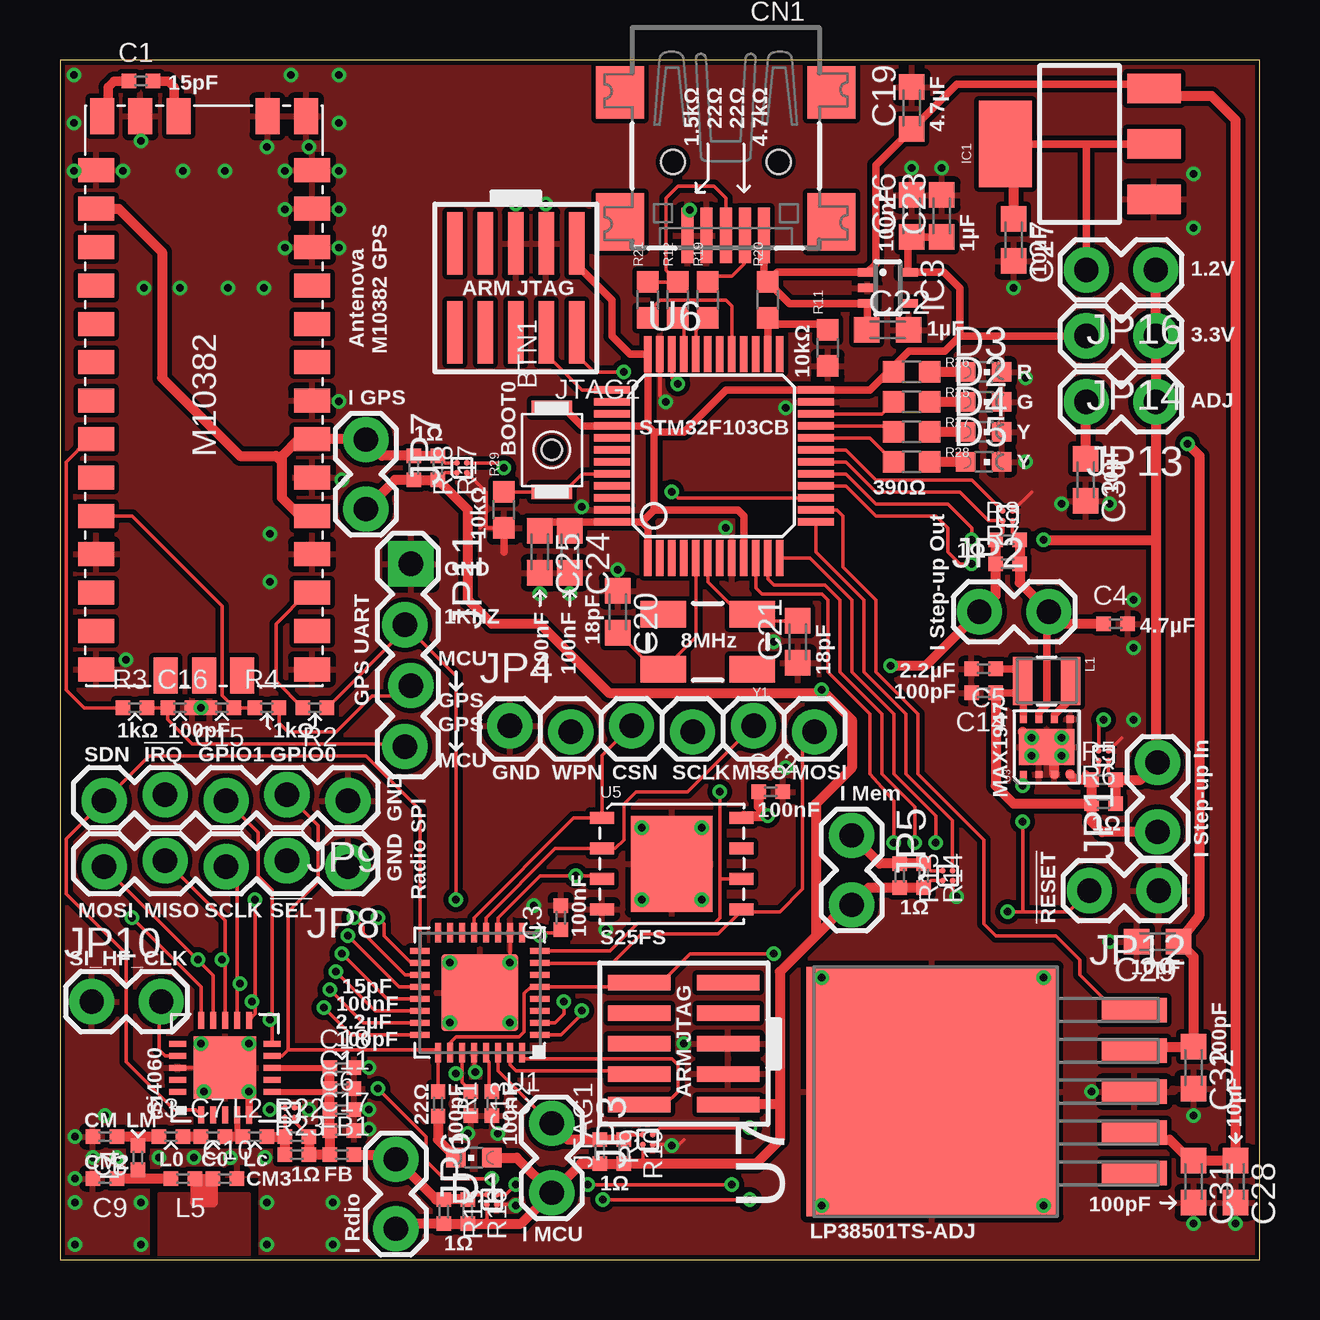
[diagram p2: board, top side]
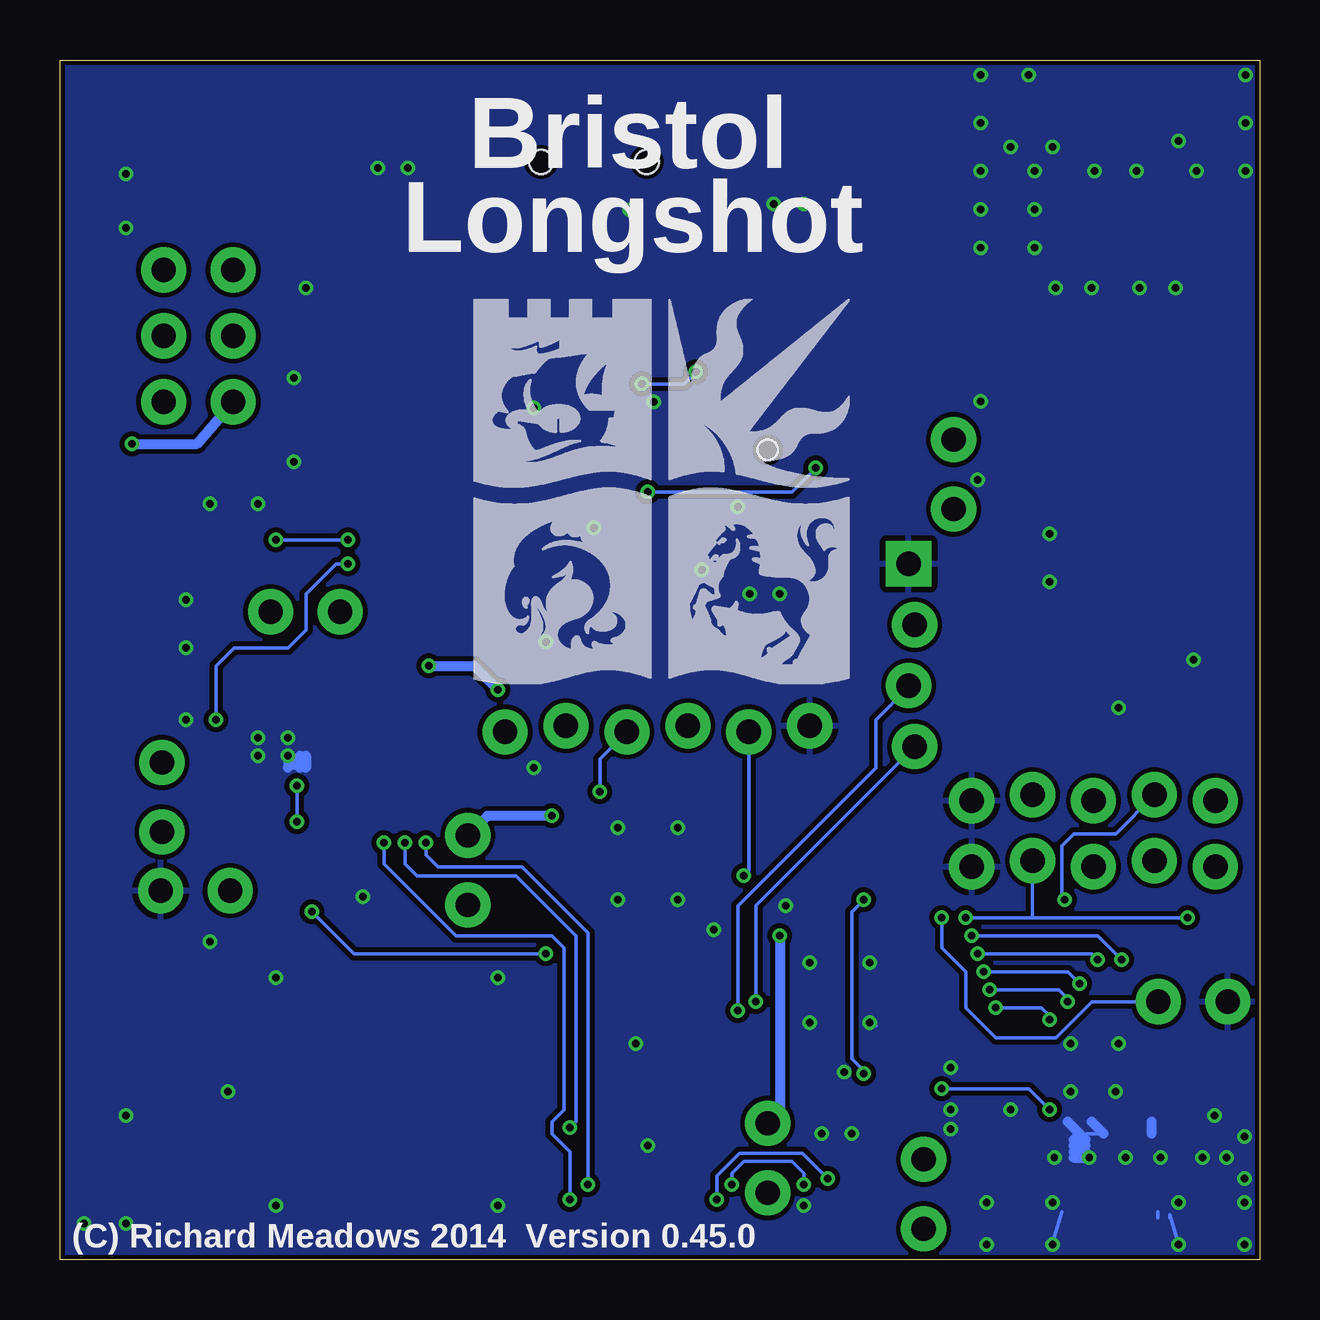
[diagram p3: board, bottom side, seen from below]

Size 50 x 50 mm. Coordinates in mm from the lower left corner, seen from the top.
Outline: 0,0 50,0 50,50 0,50 0,0
Copper layers (1*16): Top 0.035mm / dielectric 1.5mm / Bottom 0.035mm
Design rules "hackvana": minimum track width 6mil, minimum drill 0.3mm, track to track 6mil, track to pad 6mil, pad to pad 6mil, via to via 6mil, smd to smd 0mil, copper to edge 6mil, drill to drill 6mil, minimum pad ring 10mil, minimum via ring 6mil, stop-mask expansion 2mil, vias tented up to drill 100mil, thermal gap 10mil

### Footprints (pad centres in the part's own frame; a part is rotated, then mirrored left to right if it is on the bottom)
B3U-1000P(M)-B = smd 0.6 x 1.7: 1 -1.75,0; 2 1.75,0 | hole 0.85: 0,0
_0402 = smd 0.6 x 0.6: 1 -0.508,0; 2 0.508,0
C0603K = smd 1.05 x 1.08: 1 -0.875,0; 2 0.875,0
USB-MINIB = smd 0.5 x 2.308: D+ 0,4.064; D- -0.8,4.064; GND 1.6,4.064; ID 0.8,4.064; VBUS -1.6,4.064 | smd 2 x 2.2: GND1 -4.4,-1.9; GND4 4.4,-1.9 | smd 2 x 2.4: GND2 -4.4,3.5; GND3 4.4,3.5 | hole 1: -2.2,1; 2.2,1
CHIPLED_0603 = smd 0.8 x 0.8: A 0,-0.75; C 0,0.75
SOT223 = smd 1.219 x 2.235: 1 -2.311,-3.099; 2 0,-3.099; 3 2.311,-3.099 | smd 3.6 x 2.2: 4 0,3.099
SC70-5L = smd 0.35 x 0.8: 1 -0.65,-0.85; 2 0,-0.85; 3 0.65,-0.85; 4 0.65,0.85; 5 -0.65,0.85
1X02_LOCK = drill 1.016 pad 1.88: 1 -0.178,0; 2 2.718,0
1X06_LOCK = drill 1.016 pad 1.88: 1 0,0; 2 2.54,-0.254; 3 5.08,0; 4 7.62,-0.254; 5 10.16,0; 6 12.7,-0.254
1X05_LOCK = drill 1.016 pad 1.88: 1 0,0.127; 2 2.54,-0.127; 3 5.08,0.127; 4 7.62,-0.127; 5 10.16,0.127
1X04_LOCK = drill 1.016 pad 1.88 square: 1 0,0.127 | drill 1.016 pad 1.88: 2 2.54,-0.127; 3 5.08,0.127; 4 7.62,-0.127
2X05_1.27MM_SMT = smd 0.65 x 2.6: 1 -2.54,-1.85; 2 -2.54,1.85; 3 -1.27,-1.85; 4 -1.27,1.85; 5 0,-1.85; 6 0,1.85; 7 1.27,-1.85; 8 1.27,1.85; 9 2.54,-1.85; 10 2.54,1.85
1007 = smd 2 x 0.8: 1 0,1; 2 0,-1
0603-MINI = smd 0.9 x 0.9: 1 -0.75,0; 2 0.75,0
QFN32_5MM = smd 0.8 x 0.25: 1 -2.5,1.75; 2 -2.5,1.25; 3 -2.5,0.75; 4 -2.5,0.25; 5 -2.5,-0.25; 6 -2.5,-0.75; 7 -2.5,-1.25; 8 -2.5,-1.75; 17 2.5,-1.75; 18 2.5,-1.25; 19 2.5,-0.75; 20 2.5,-0.25; 21 2.5,0.25; 22 2.5,0.75; 23 2.5,1.25; 24 2.5,1.75 | smd 0.25 x 0.8: 9 -1.75,-2.5; 10 -1.25,-2.5; 11 -0.75,-2.5; 12 -0.25,-2.5; 13 0.25,-2.5; 14 0.75,-2.5; 15 1.25,-2.5; 16 1.75,-2.5; 25 1.75,2.5; 26 1.25,2.5; 27 0.75,2.5; 28 0.25,2.5; 29 -0.25,2.5; 30 -0.75,2.5; 31 -1.25,2.5; 32 -1.75,2.5 | smd 3.2 x 3.2: 33 0,0
QFN20 = smd 0.7 x 0.25: 1 -1.97,1; 2 -1.97,0.5; 3 -1.97,0; 4 -1.97,-0.5; 5 -1.97,-1; 11 1.97,-1; 12 1.97,-0.5; 13 1.97,0; 14 1.97,0.5; 15 1.97,1 | smd 0.25 x 0.7: 6 -1,-1.97; 7 -0.5,-1.97; 8 0,-1.97; 9 0.5,-1.97; 10 1,-1.97; 16 1,1.97; 17 0.5,1.97; 18 0,1.97; 19 -0.5,1.97; 20 -1,1.97 | smd 2.6 x 2.6: PAD 0,0
TDFN8 = smd 0.3 x 0.3: 1 -1.15,0.975; 2 -1.15,0.325; 3 -1.15,-0.325; 4 -1.15,-0.975; 5 1.15,-0.975; 6 1.15,-0.325; 7 1.15,0.325; 8 1.15,0.975 | smd 1.5 x 2.3: PAD 0,0
ANTENOVA_GPS_M10382 = smd 1 x 1.5: 1_ANT_IN -1.05,11.65; 2_GND -2.65,11.65; 3_ANT_OUT -4.25,11.65; 18_SDA -1.6,-11.65; 19_SCL 0,-11.65; 20_SAFEBOOT_N/TDI 1.6,-11.65; 35_GND 4.25,11.65; 36_GND 2.65,11.65 | smd 1.5 x 1: 4_GND -4.5,9.4; 5_VIO -4.5,7.8; 6_USB_DP -4.5,6.2; 7_USB_DM -4.5,4.6; 8_SO -4.5,3; 9_CFG_GPS0_SCK -4.5,1.4; 10_SPI_SELECT -4.5,-0.2; 11_TX -4.5,-1.8; 12_V_TH -4.5,-3.4; 13_RX -4.5,-5; 14_GND -4.5,-6.6; 15_V_BCKUP -4.5,-8.2; 16_SI -4.5,-9.8; 17_GND -4.5,-11.4; 21_GND 4.5,-11.4; 22_TCK 4.5,-9.8; 23_TIMEPULSE/TDO 4.5,-8.2; 24_GND 4.5,-6.6; 25_VDD_RF 4.5,-5; 26_GND 4.5,-3.4; 27_VCC 4.5,-1.8; 28_GND 4.5,-0.2; 29_EXT_INTERRUPT 4.5,1.4; 30_V_EN 4.5,3; 31_CFG 4.5,4.6; 32_VDD_USB 4.5,6.2; 33_GND 4.5,7.8; 34_GND 4.5,9.4
WSON8 = smd 1 x 0.5: 1 -2.9,1.905; 2 -2.9,0.635; 3 -2.9,-0.635; 4 -2.9,-1.905; 5 2.9,-1.905; 6 2.9,-0.635; 7 2.9,0.635; 8 2.9,1.905 | smd 3.4 x 4: PAD 0,0
TQFP48 = smd 0.3 x 1.5: 1 -2.75,-4.25; 2 -2.25,-4.25; 3 -1.75,-4.25; 4 -1.25,-4.25; 5 -0.75,-4.25; 6 -0.25,-4.25; 7 0.25,-4.25; 8 0.75,-4.25; 9 1.25,-4.25; 10 1.75,-4.25; 11 2.25,-4.25; 12 2.75,-4.25; 25 2.75,4.25; 26 2.25,4.25; 27 1.75,4.25; 28 1.25,4.25; 29 0.75,4.25; 30 0.25,4.25; 31 -0.25,4.25; 32 -0.75,4.25; 33 -1.25,4.25; 34 -1.75,4.25; 35 -2.25,4.25; 36 -2.75,4.25 | smd 1.5 x 0.3: 13 4.25,-2.75; 14 4.25,-2.25; 15 4.25,-1.75; 16 4.25,-1.25; 17 4.25,-0.75; 18 4.25,-0.25; 19 4.25,0.25; 20 4.25,0.75; 21 4.25,1.25; 22 4.25,1.75; 23 4.25,2.25; 24 4.25,2.75; 37 -4.25,2.75; 38 -4.25,2.25; 39 -4.25,1.75; 40 -4.25,1.25; 41 -4.25,0.75; 42 -4.25,0.25; 43 -4.25,-0.25; 44 -4.25,-0.75; 45 -4.25,-1.25; 46 -4.25,-1.75; 47 -4.25,-2.25; 48 -4.25,-2.75
TO170P1435X457-6N = smd 1.016 x 2.692: 1 -3.404,-8.28; 2 -1.702,-8.28; 3 0,-8.28; 4 1.702,-8.28; 5 3.404,-8.28 | smd 10.414 x 10.465: 6 0,0.152
WCSP-4 = smd 0.24 x 0.24: A1 -0.2,-0.2; A2 -0.2,0.2; B1 0.2,-0.2; B2 0.2,0.2
CRYSTAL-SMD-5X3 = smd 1.9 x 1.1: 1 -1.85,-1.15; 2 1.85,-1.15; 3 1.85,1.15; 4 -1.85,1.15

### Placement (x,y rotation side)
BTN1  20.5,33.75 90 top
C1  3.38,49.12 0 top
C2  18,6.5 270 top
C3  20.88,14.25 90 top
C4  44,26.5 0 top
C5  38.5,24.62 180 top
C6  11.75,6.25 0 top
C7  6.38,5.12 0 top
C8  1.88,5.12 180 top
C9  1.88,3.38 180 top
C10  6.88,3.38 0 top
C11  11.75,7.12 0 top
C12  29.62,19.5 0 top
C13  17.12,6.5 270 top
C14  38.5,23.62 180 top
C15  6.75,23 180 top
C16  5,23 0 top
C17  11.75,5.38 0 top
C18  11.75,8 0 top
C19  35.5,48 90 top
C20  23.25,27 270 top
C21  30.75,25.75 90 top
C22  34.5,38.75 0 top
C23  36.75,43.5 90 top
C24  21.25,29.5 270 top
C25  20,29.5 270 top
C26  35.5,43.5 90 top
C27  39.75,42.5 270 top
C28  49,3.25 270 top
C29  45.75,13.25 180 top
C30  42.75,32.5 270 top
C31  47.25,3.25 270 top
C32  47.25,8 270 top
CN1  27.75,46.75 180 top
D1  17.25,4.25 90 top
D2  38.5,35.75 270 top
D3  38.5,37 270 top
D4  38.5,34.5 270 top
D5  38.5,33.25 270 top
FB1  11.75,4.38 0 top
IC1  42.5,46.5 90 top
IC3  34.5,40.5 270 top
JP1  45.75,18 90 top
JP2  38.5,27 0 top
JP3  20.5,5.5 270 top
JP4  18.75,22.25 0 top
JP5  33,17.5 270 top
JP6  14,4 270 top
JP7  12.75,34 270 top
JP8  12,16.5 180 top
JP9  12,19.25 180 top
JP10  1.5,10.75 0 top
JP11  14.5,29 270 top
JP12  45.62,15.38 180 top
JP13  45.5,35.75 180 top
JP14  45.5,38.5 180 top
JP16  45.5,41.25 180 top
JTAG1  26,9 90 top
JTAG2  19,40.5 180 top
L1  41.12,24.12 270 top
L2  8.12,5.12 0 top
L3  4.62,5.12 0 top
L4  3.25,4.25 90 top
L5  5.12,3.38 180 top
R1  15.76,6.49 270 top
R2  10.62,23 180 top
R3  3.12,23 0 top
R4  8.62,23 0 top
R5  43.5,20 0 top
R6  43.5,19 0 top
R7  39.5,29 0 top
R8  39.5,30 0 top
R9  22.5,4.5 270 top
R10  23.5,4.5 270 top
R11  32,38 90 top
R12  25.75,40 90 top
R13  35,16 270 top
R14  36,16 270 top
R15  16,2 270 top
R16  17,2 270 top
R17  15.75,33 270 top
R18  14.75,33 270 top
R19  27,40 90 top
R20  29.5,40 90 top
R21  24.5,40 90 top
R22  9.88,5.12 0 top
R23  9.88,4.38 0 top
R25  35.5,35.75 0 top
R26  35.5,37 0 top
R27  35.5,34.5 0 top
R28  35.5,33.25 0 top
R29  18.5,31.25 90 top
U1  17.5,11.12 180 top
U2  6.88,8 90 top
U3  41.12,21.38 90 top
U4  6,36 0 top
U5  25.5,16.5 0 top
U6  27.25,33.5 0 top
U7  36.5,7 90 top
U$2  43.5,21 90 top
U$5  39.5,31 90 top
U$30  24.5,5 0 top
U$48  37,16 0 top
U$60  18,2.5 0 top
U$62  16.75,33 0 top
U$99  9.57,6.12 90 top
Y1  27,25.75 180 top

### Tracks (layer width: path | path; a pad name or v marks a point on that pad's centre or on a via)
1.2VREG_OUT
  Top 0.305: JP16.2 42.78,46.5 | 42.78,46.5 IC1.4 | IC1.2 42.78,46.5
  Top 0.406: IC1.4 39.88,46.03 39.75,45.9 C27.1
1.8V  (via drill 0.3)
  Top 0.152: U$48.A1 36.31,15.8 R14.2 | U$62.A1 16.06,32.8 R17.2 | R8.1 39.3,30.31 U$5.A2 38.7,30.8 37.5,32 34,32 32.75,33.25 U6.18 | U$30.A1 24.3,4 24.5,4 | U$60.A1 17.8,1.49 17.75,1.49
  Top 0.406: JP6.2 14.21,1.49 R15.2 R16.2 17.75,1.49 19.21,1.49 JP3.2 | JP3.2 21.71,3.99 R9.2 R10.2 24.5,4 29,4 30,5 30,6.5 | R14.2 R13.2 33.71,15.49 JP5.2 32.78,14.78 31.5,13.5 | JP7.2 13.96,32.49 R18.2 R17.2 17,31.24 17,27.5 18,26.5 20,26.5 22.88,23.62 31.88,23.62 | R8.1 R7.1 38.99,27.67 JP2.1 36.07,24.75 v34.62,24.75 | D1.A 19.03,4.25 JP3.2 | 31.5,13.5 30,12 30,6.5 | JTAG1.1 27.89,6.5 30,6.5 | 31.88,23.62 33,22.5 33,20.5 31.5,19 31.5,13.5 | 31.88,23.62 v31.75,23.75
  Bottom 0.406: v34.62,24.75 32.75,24.75 v31.75,23.75
3.3V
  Top 0.305: U6.1 24.5,30.5 24.25,30.75 | 24.25,30.75 U6.48 21.12,30.75 | U6.9 28.5,31 28.25,31.25 24.75,31.25 | 24.75,31.25 24.25,30.75 | 24.5,34.75 U6.40 21.75,34.75 21,35.5 BTN1.2 | 24.5,34.75 24.75,34.5 | 24.75,34.5 24.75,31.25 | 21.12,30.75 C24.1 | 24.5,34.75 U6.36 23.75,37.75 23,38.5 23,40 21.5,41.5 21.5,42.31 JTAG2.1 | 37.5,38.5 37.5,40.5 36.85,41.15 IC3.5 35.35,42.48 C26.1 C23.1 | 37.5,38.5 JP14.2 | 37.5,38.5 36.88,37.88 35.38,37.88 34.5,37 | 24.75,34.5 26,34.5 27.75,36.25 U6.24 33.75,36.25 34.5,37 | 21.12,30.75 20.38,30.75 C25.1 | 34.5,37 R26.1
5.0V
  Top 0.305: CN1.VBUS 29.35,40.9 R20.2 | R20.2 29.9,41.15 IC3.1 34,41.5 34,45.62 C19.1 37.38,49 45.41,49 IC1.3 | R20.2 30.4,39.85 IC3.3 33.65,38.77 C22.1
  Top 0.406: IC1.3 45.91,48.5 48,48.5 49,47.5 C28.1 C31.1 47.12,4.12 46.25,5 45.08,5 U7.2
ADJ_REG_OUT  (via drill 0.3)
  Top 0.406: v47,34 47.5,33.5 47.5,14.38 C29.1 47.25,12.62 C32.1 44.95,8.88 U7.4 | C30.1 42.75,35.72 JP13.2
  Bottom 0.406: v47,34 44.28,34 JP13.2
ADJ_REG_SWITCHING
  Top 0.152: U6.14 32.38,31.25 32.62,31 32.62,28.88 34,27.5 34,24.5 35.75,22.75 35.75,20.25 38.5,17.5 38.5,14 39,13.5 41.5,13.5 42.5,12.5 42.5,11.88 44,10.38 44.75,10.38 U7.5
AN_GPS_RX
  Top 0.152: R4.1 C15.1 6.75,23.51 6.75,27.25 3,31 U4.13_RX
AN_GPS_TX
  Top 0.152: 1.29,34.2 U4.11_TX 1.2,34.2 0.25,33.25 0.25,23.75 1,23 R3.1
ANT
  Top 0.152: 6.38,3.25 6.24,3.25 | 6.24,3.25 6.12,3.25 5.88,3.25 5.76,3.25 L5.1 | 6.24,3.25 C10.1
  Top 0.406: L5.1 C10.1 | 6.38,3.25 6.38,2.38 5.62,2.38 5.62,3.25 | 6.12,2.75 6.12,3.25 | 5.88,3.25 5.88,2.75
  pour Top: 4.12,0 7.88,0 7.88,2.75 4.12,2.75
BOOT0
  Top 0.152: U6.44 21.75,32.75 21,32 BTN1.1 R29.2
D+
  Top 0.152: CN1.D+ 27.75,44.25 27.25,44.75 25.75,44.75 25.25,44.25 25.25,41.25 R12.2 R21.2
D-
  Top 0.152: R19.2 27.25,41 28,41 28.5,41.5 28.5,42.64 CN1.D-
FILTER1
  Top 0.406: L3.1 3.25,5.12 | 3.25,5.12 C8.1 | L4.2 3.25,5.12
FILTER2
  Top 0.406: L5.2 3.25,3.38 | 3.25,3.38 C9.1 | L4.1 3.25,3.38
GND  (via drill 0.3)
  Top 0.152: U1.10 v18.75,12.38 U1.33 17.25,10.88 | U2.18 5.62,8 5.88,7.75 | 17.25,32.5 U$62.B1 17.75,32 17.75,30.75 | U$2.B1 44.25,21.75 | v26.25,43.75 26.25,42.79 CN1.GND | U6.35 25,36 v25.25,35.75 | U$5.B1 40.5,32 | 17.75,30.75 17.5,30.5 | U$30.B1 25.8,4.8 26,5 | v19,2.25 19,2.3 U$60.B1 | U$48.B1 37.2,15.3 v37.38,15.12 | 17.75,30.75 17.75,30.5 R29.1 | U$99.B1 10.38,6.33 v10.38,6.25 | U1.28 17.25,7.88 v17.31,7.81
  Top 0.305: 5.88,7.75 v6,7 | U2.5 v7.88,7 | R29.1 18.5,29.5
  Top 0.406: 40.12,22 v40.5,21.75 40.73,21.4 U3.PAD 41.42,21.07 U3.3
  Bottom 0.152: 7.75,4.25 7.75,4.38 | 7.75,4.38 7.75,4.5 7.75,4.75 | 7.75,5 7.75,5.25 7.5,5.25 | 7.75,4.38 7.62,4.38 | 7.25,5 7.25,5.25 6.5,5.25 | v3.38,0.62 3.75,1.88 3.75,1.75 | 4.25,2 4.25,1.75 | 8.25,2 8.62,0.75 v8.62,0.62 | v16.25,9.88 16.25,9.75 16,9.75
  Bottom 0.406: 40,21 40,20.5 | 40.25,20.62 v40.5,21 40.5,20.5 | 39.75,21 39.75,20.5 | 6.5,5.25 7,5.75 | 7.5,5.25 8,5.75 | 7.75,5 7.25,5 | 4.5,5.25 4.5,5.75 | 7.75,4.25 7.25,4.25 | 7.75,4.5 7.25,4.5 | 7.75,4.75 7.25,4.75
  other vias: 16.25,12.38 18.75,9.88 5.88,9 7.88,9 1.88,6 0.62,5.12 41.75,21 41.75,21.75 5.88,23 12.88,8 12.88,6.25 12.88,5.44 0.62,2.38 0.62,0.62 3.38,2.38 11.38,0.62 11.38,2.38 8.62,2.38 0.58,45.38 11.62,35.77 11.62,42.17 11.62,43.77 11.62,45.38 2.75,25 11.75,32.5 8.75,28.25 8.75,30.25 5,40.5 3.5,40.5 7,40.5 8.5,40.5 9.38,42.17 9.38,43.77 9.38,45.38 3.38,46.62 2.62,45.38 8.62,46.38 10.38,46.38 0.58,47.38 0.58,49.38 11.62,47.38 11.62,49.38 9.62,49.38 5.12,45.38 6.88,45.38 21.75,31.38 19,44 20.25,44 27.75,30.5 30.25,35.5 23.25,28.75 29.75,25.75 21.25,27.75 20,27.75 40.25,36.75 40.25,33.25 26,9 25.5,4.75 18.25,5.25 17,5.25 44.75,22.5 44.75,25.5 44.75,27.5 22.75,13.75 19.75,14.75 30.25,20.5 35.5,45.5 36.75,45.5 39.75,40.5 47.25,45.25 47.25,43 31.75,11.75 41,11.75 31.75,2.25 41,2.25 43,7 47.25,6 43.75,13.25 49,1.5 47.25,1.5 41.75,31.5 43.75,31.5 2.38,4.25 1.38,4.25 4.12,4.25 5.58,4.25 7.09,4.25 8.55,4.25 0.62,3.38 24.25,15 26.75,15 26.75,18 24.25,18
  pour Top (isolate 0.2): 0,50 50,50 50,0 8.38,0 8.38,3.5 3.62,3.5 3.62,0 0,0
  pour Bottom (isolate 0.2): 0,50 50,50 50,0 0,0
GPS_ANT_IN
  Top 0.4: C1.2 4.5,49.12 4.75,48.88 4.75,47.85 U4.1_ANT_IN
GPS_ANT_OUT
  Top 0.4: C1.1 2.25,49.12 2,48.88 2,47.9 U4.3_ANT_OUT
GPS_RX  (via drill 0.3)
  Top 0.152: R4.2 9.13,22.37 9.5,22 11.5,22 13,23.5 14.21,23.5 JP11.3 | U1.1 20.88,9.38 21.75,10.25 v21.75,10.38
  Bottom 0.152: v21.75,10.38 21.75,14.75 16,20.5 16,22.5 14.63,23.87 JP11.3
GPS_TX  (via drill 0.3)
  Top 0.152: R3.2 C16.1 4.49,22.51 5.5,21.5 14.25,21.5 JP11.4 | v21,10.75 21,10.25 20.62,9.88 U1.2
  Bottom 0.152: v21,10.75 21,14.75 JP11.4
I_PA  (via drill 0.3)
  Top 0.152: U$99.B2 8.75,6.33 v8.75,6.25 | v18,3.38 16,3.38 15.25,4.12 15.25,5.12 v13.25,7.12 | U6.12 31.25,29.25 33,27.5 33,24.5 34.75,22.75 34.75,20.25 36.5,18.5 v36.5,17.38 | v22.62,2.5 v28.75,2.5
  Bottom 0.152: v13.25,7.12 9.62,7.12 v8.75,6.25 | v36.5,17.38 36.5,16.5 33.5,13.5 29.5,13.5 29,13 29,6.25 29.5,5.75 29.5,5.25 28.75,4.5 v28.75,2.5 | v18,3.38 19.06,4.44 21.69,4.44 22.62,3.5 v22.62,2.5
I_STEPUP_IN  (via drill 0.3)
  Top 0.152: U6.16 32.75,32.25 34,31 36.5,31 37,30.5 37,29.5 37.5,29 v38,29 | U$2.B2 43.3,22.3 v43.5,22.5
  Bottom 0.152: v38,29 38.5,29 39.75,27.75 39.75,26.25 40.5,25.5 42.75,25.5 43.5,24.75 v43.5,22.5
I_STEPUP_OUT
  Top 0.152: U$5.B2 38,32.5 34,32.5 32.75,33.75 U6.19
I_VDD_GPS  (via drill 0.3)
  Top 0.152: U$62.B2 18.3,33.2 v18.5,33 | U6.15 25.75,31.75 v25.5,32
  Bottom 0.152: v25.5,32 19.5,32 v18.5,33
I_VDD_MEM
  Top 0.152: U$48.B2 37.2,18.3 35.25,20.25 35.25,22.75 33.5,24.5 33.5,27.5 31.88,29.12 31.5,29.5 U6.13
I_VDD_RADIO  (via drill 0.3)
  Top 0.152: U6.10 29,28 29.25,27.75 31.75,27.75 32,27.5 32,24.5 33.75,22.75 33.75,20.25 34.75,19.12 v34.75,17.38 | U$60.B2 18.57,2.7 v19,3.12 | v22,3.12 v28,3.12
  Bottom 0.152: v28,3.12 28,13.62 30.75,16.38 34.25,16.38 34.75,16.88 v34.75,17.38 | v19,3.12 19,3.6 19.5,4.1 21.5,4.1 22,3.6 v22,3.12
I_VDD_SAMD20  (via drill 0.3)
  Top 0.152: U6.11 29.5,28.38 29.75,28.12 31.88,28.12 32.5,27.5 32.5,24.5 34.25,22.75 34.25,20.25 35.62,18.88 v35.62,17.38 | U$30.B2 25,5.5 v28.75,5.5
  Bottom 0.152: v28.75,5.5 28.5,5.75 28.5,13.5 31,16 35.12,16 35.62,16.5 v35.62,17.38
LED0
  Top 0.152: U6.20 33.75,34.25 R28.1
LED1
  Top 0.152: U6.21 34.5,34.75 R27.1
LED2
  Top 0.152: U6.22 34.25,35.25 R25.1
LED_RES
  Top 0.305: 16.24,4.25 D1.C
  Top 0.406: R1.2 15.76,4.99 D1.C
LPC_XTAL2
  Top 0.152: U6.6 27,28.25 28.35,26.9 Y1.1 29.12,26.62 C21.2
LX
  Top 0.305: U3.6 41.45,22.7 42.12,23.38 L1.1
MEM_CSN
  Top 0.152: JP4.3 22.6,21.02 U5.1 21.41,18.41 17.25,14.25 U1.13
MEM_MISO
  Top 0.152: U1.12 17.75,14.25 20.64,17.14 U5.2 23.14,17.14 23.5,17.5 23.5,19 24,19.5 26.16,19.5 JP4.5
MEM_MOSI
  Top 0.152: U1.7 20.03,12.34 23.01,12.34 24.23,13.56 27.43,13.56 28.4,14.53 U5.5 28.5,14.5 30,14.5 30.95,15.45 30.95,21.5 JP4.6
MEM_SCK  (via drill 0.3)
  Top 0.152: 27.5,15.87 27.5,14.24 27.28,14.02 24.08,14.02 22.93,12.88 U1.8 | 27.5,15.87 v27.5,19.5 | U5.6 27.5,15.87
  Bottom 0.152: v27.5,19.5 27.5,20.87 JP4.4
MEM_WPN  (via drill 0.3)
  Top 0.152: U5.3 22.46,16 v21.5,16 20,16 18.25,14.25 U1.11
  Bottom 0.152: JP4.2 21.29,16.21 v21.5,16
N$2
  Top 0.406: D2.A R25.2
N$4
  Top 0.406: D3.A R26.2
N$6
  Top 0.406: D4.A R27.2
N$8
  Top 0.406: D5.A R28.2
OSC_IN
  Top 0.152: U6.5 26.5,25.95 Y1.3 24.77,24.6 C20.2
RADIO_VDD
  Top 0.152: 11.24,7.25 C11.1 11.12,7.25 | R22.2 9.78,5.73 U$99.A1
  Top 0.254: U2.8 C18.1 | U2.6 11.12,7 C11.1
  Top 0.406: C17.1 C6.1 C11.1 C18.1 | C17.1 11.26,5.36 | C17.1 FB1.1 R23.2 R22.2
RESETN  (via drill 0.3)
  Top 0.152: U3.1 40.12,20.23 | U1.26 16.25,9.03 16.5,9.28 19.12,9.28 19.34,9.5 19.34,11.09 19.62,11.38 U1.5 23.98,11.38 JTAG1.10 24.19,11.5 25,11.5 26.25,12.75 v29.75,12.75 | v39.5,14.5 40.12,14.5 | JP12.2 42.03,14.5 40.5,14.5 40.12,14.5 | v40.12,18.25 40.12,14.5
  Top 0.305: U3.1 40.15,19.77 v40.12,19.75
  Bottom 0.152: v39.5,14.5 37.75,12.75 v29.75,12.75 | v40.12,19.75 v40.12,18.25
RF_OUT
  Top 0.152: U2.4
  Top 0.254: U2.4 7.38,5.12 C7.2
  Top 0.305: 7.12,5.19 C7.2 6.88,5.2
  Top 0.406: L2.1 C7.2
SI_GPIO0
  Top 0.152: U2.9 9.25,8.5 9.5,8.75 | 9.5,8.75 9.5,14.5 10.75,15.75 10.75,18.09 JP9.2 | 9.5,8.75 15.75,8.75 U1.25 R1.1
SI_GPIO1  (via drill 0.3)
  Top 0.152: JP9.3 8.25,17.79 8.25,16 8.85,15.4 U2.10 8.85,9.9 v8.75,10 | U1.24 12.12,9.38 v11,10.5
  Bottom 0.152: v11,10.5 9.1,10.5 8.75,10.15 v8.75,10
SI_HF_CLK  (via drill 0.3)
  Top 0.152: U2.17 4.38,8.5 4.12,8.75 4.12,10.72 JP10.2 | v13.25,14.25 13.5,14 13.5,13.5 14.62,12.38 U1.18
  Bottom 0.152: JP10.2 7,10.75 8.5,9.25 11,9.25 12.25,10.5 12.25,12 13.25,13 v13.25,14.25
SI_MISO  (via drill 0.3)
  Top 0.152: U2.13 6.88,12.62 | JP8.4 6.88,14.13 6.88,12.62 | 6.88,12.62 v6.75,12.5 | U1.21 13.62,10.88 v11.75,12.75
  Bottom 0.152: v11.75,12.75 7,12.75 v6.75,12.5
SI_MOSI  (via drill 0.3)
  Top 0.152: U2.14 6.38,11.84 5.75,12.46 | 5.75,12.46 JP8.5 | U1.20 14.12,11.38 v12,13.5 | 5.75,12.46 v5.75,12.5
  Bottom 0.152: v12,13.5 6.75,13.5 v5.75,12.5
SI_NIRQ  (via drill 0.3)
  Top 0.152: U2.11 8.12,10.25 8.12,10.62 | 8.12,10.62 v8.12,15 | 8.12,10.62 v8,10.75 | U1.23 12.62,9.88 v11.25,11.25
  Bottom 0.152: v8.12,15 8.25,15.12 8.25,17.25 7.75,17.75 6,17.75 JP9.4 | v11.25,11.25 8.38,11.25 7.94,10.81 | 7.94,10.81 7.88,10.75 | v8,10.75 7.94,10.81
SI_NSEL  (via drill 0.3)
  Top 0.152: U2.15 5.88,11.38 v3,14.25 | U1.19 14.38,11.88 12.62,13.62 12.62,13.88 v12.25,14.25
  Bottom 0.152: 9.46,14.25 JP8.2 | v12.25,14.25 9.46,14.25 | 9.46,14.25 v3,14.25
SI_SCLK  (via drill 0.3)
  Top 0.152: JP8.3 7.38,15.92 U2.12 7.38,11.38 v7.5,11.5 | U1.22 13.12,10.38 v11.5,12
  Bottom 0.152: v11.5,12 8,12 v7.5,11.5
SI_SDN
  Top 0.152: U2.1 5.66,6.25 4.75,6.25 2.75,8.25 2.75,12.75 0.25,15.25 0.25,17.53 JP9.5 3.72,21 12.75,21 15,18.75 U1.17
STEPUP_IN
  Top 0.152: U$2.A2 43.3,20.31 R5.1
  Top 0.305: 42.75,20.24 R5.1 | C5.1 40.12,24.62 L1.2 40.12,23.75 40,23.62 | C14.1 40,23.62 | 40,23.62 40.12,23.62 40.15,23.6 U3.8
  Top 0.406: R6.1 R5.1 42.33,20 U3.4 | JP1.1 43.43,17.82 43,18.25 R6.1 | R6.1 39.75,19 39,19.75 C14.1
STEPUP_OUT
  Top 0.152: U$5.A1 39.7,30.31 R8.2
  Top 0.305: 41.25,26.97 JP2.2 41.12,26.91 41.12,23.12 40.8,22.8 U3.7
  Top 0.406: R8.2 R7.2 40.01,28.21 JP2.2 41.72,26.5 C4.1
STM_SWDCLK
  Top 0.152: U6.37 21.75,36.25 20.27,37.73 JTAG2.4 20.5,38.42
STM_SWDIO  (via drill 0.3)
  Top 0.152: U6.34 25.5,36.75 v25.75,36.5 | v23.5,37 22.25,37 21.54,37.71 JTAG2.2 21.5,38.61
  Bottom 0.152: v25.75,36.5 24,36.5 v23.5,37
SWDCLK
  Top 0.152: JTAG1.4 24,7.88 19,7.88 18.75,8.12 U1.31
SWDIO
  Top 0.152: U1.32 19.25,8.38 25.5,8.38 25.75,8.12 25.75,7 25.21,6.46 JTAG1.2 24.46,6.46
TANK
  Top 0.406: C7.1 L3.2
TIME_1KHZ  (via drill 0.3)
  Top 0.152: R2.1 14.37,26.24 JP11.2 16.5,24.33 v16.5,15 | U1.27 16.75,7.75 | C13.1 16.75,7.38 16.75,7.75 | 16.75,7.75 v16.5,7.75
  Bottom 0.152: 14.37,26.24 JP11.2 | v16.5,15 17,14.5 17,8.38 16.5,7.88 v16.5,7.75
TIME_1KHZ_DRIVE
  Top 0.152: U4.23_TIMEPULSE/TDO 10.3,27.8 9,26.5 9,24.12 R2.2
USB_DM
  Top 0.152: R19.1 26.5,38.75 U6.32
USB_DP
  Top 0.152: R12.1 26,39 U6.33 26,37.25
USB_ENUMERATE
  Top 0.152: R21.1 24.5,39.5 | 24.75,39.5 24.5,39.5 | 24.5,39.5 25,40 27.75,40 28,39.75 U6.29
VBUS
  Top 0.305: U6.26 R20.1 29.75,39 31.75,39 R11.2
VDD_CORE
  Top 0.152: U1.29 17.75,8.38 17.88,8.25 17.88,7.13 C2.1
VDD_GPS
  Top 0.152: U$62.A2 16.06,33.2 R17.1
  Top 0.406: R17.1 R18.1 13.42,33.51 JP7.1 12.73,34.2 U4.27_VCC 9.95,34.2 9.25,33.5 9.25,33.25 | U4.25_VDD_RF 10,31 9.25,31.75 9.25,33.25 | U4.5_VIO 2.45,43.8 4.25,42 4.25,36.75 7.5,33.5 9,33.5 9.25,33.25
VDD_MEM  (via drill 0.3)
  Top 0.152: U$48.A2 36.31,16.2 R14.1
  Top 0.406: R14.1 R13.1 34.17,16.51 JP5.1 | C12.1 29.12,18.88 v29.5,18.5 28.5,18.5 U5.8
  Bottom 0.406: v29.5,18.5 32.18,18.5 JP5.1
VDD_PA
  Top 0.152: U$99.A2 R22.1
  Top 0.406: R23.1 R22.1 L2.2
VDD_RADIO
  Top 0.152: 14,4.75 JP6.1 | U$60.A2 17,2.7 R16.1
  Top 0.406: R16.1 R15.1 15.67,2.51 JP6.1 14,4.38 FB1.2
VDD_SAMD20  (via drill 0.3)
  Top 0.152: U1.9 20,13.62 | 20,13.62 20.76,13.62 C3.1 | JP3.1 20.45,5.68 18.25,7.88 U1.30 | v20,13.5 20,13.62 | U$30.A2 23.5,5.2 R10.1
  Top 0.406: R10.1 R9.1 21.17,5.01 JP3.1
  Bottom 0.406: v20,13.5 20,6.18 JP3.1
VDD_STEPUP  (via drill 0.3)
  Top 0.152: U$2.A1 43.7,20.31 R5.2 | U6.17 32.75,32.75 34,31.5 37,31.5 38,30.5 v38,30
  Top 0.406: JP16.1 JP14.1 JP13.1 45.68,30 | 45.68,30 45.68,20.79 JP1.2 45.03,20 R5.2 R6.2 | v41,30 45.68,30
  Bottom 0.152: v38,30 v41,30

### Text on the board
tPlace: 15pF | 1.5kΩ / 22Ω / 22Ω / 4.7kΩ | 4.7µF | 100nF | 1µF | 10µF | 1.2V | ARM JTAG | Antenova / M10382 GPS | 1µF | 3.3V | 10kΩ | R | I GPS | ADJ | G | 1Ω | BOOT0 | STM32F103CB | Y | Y | 390Ω | 10µF | 10kΩ | 1Ω | GPS UART | GND | 1KHZ | 18pF | 8MHz | 4.7µF | MCU | I Step-up Out | 100nF | 100nF | 18pF | 2.2µF | GPS | 100pF | 1kΩ | 100pF | 1kΩ | GPS | SDN | !IRQ | GPIO1 | GPIO0 | MCU | GND | WPN | CSN | SCLK | MISO | MOSI | I Mem | MAX1947 | GND | 100nF | 1Ω | I Step-up In | GND | Radio SPI | MOSI | MISO | SCLK | !SEL | 1Ω | !RESET | 100nF | S25FS | SI_HF_CLK | 10µF | 15pF / 100nF / 2.2µF / 100pF | 100pF | ARM JTAG | CM | LM | Si4060 | 22Ω | 10µF | 100pF | 100nF | CM2 | L0 | C0 | Lc | CM3 | 1Ω | FB | 1Ω | 100pF | I MCU | LP38501TS-ADJ | I Rdio | 1Ω
bPlace: Bristol | Longshot | (C) Richard Meadows 2014 Version 0.45.0
tValues: Devlopment | Board | BATTERY | !RESET | GND | HFCLK | RADIO
mfgcode.gbo: XxXxXxXxXxXx